# Altium schematic sheet ECU_AutoRC_UC0_r00.SchDoc
size A4; SheetNumber: 2; SheetTotal: 9
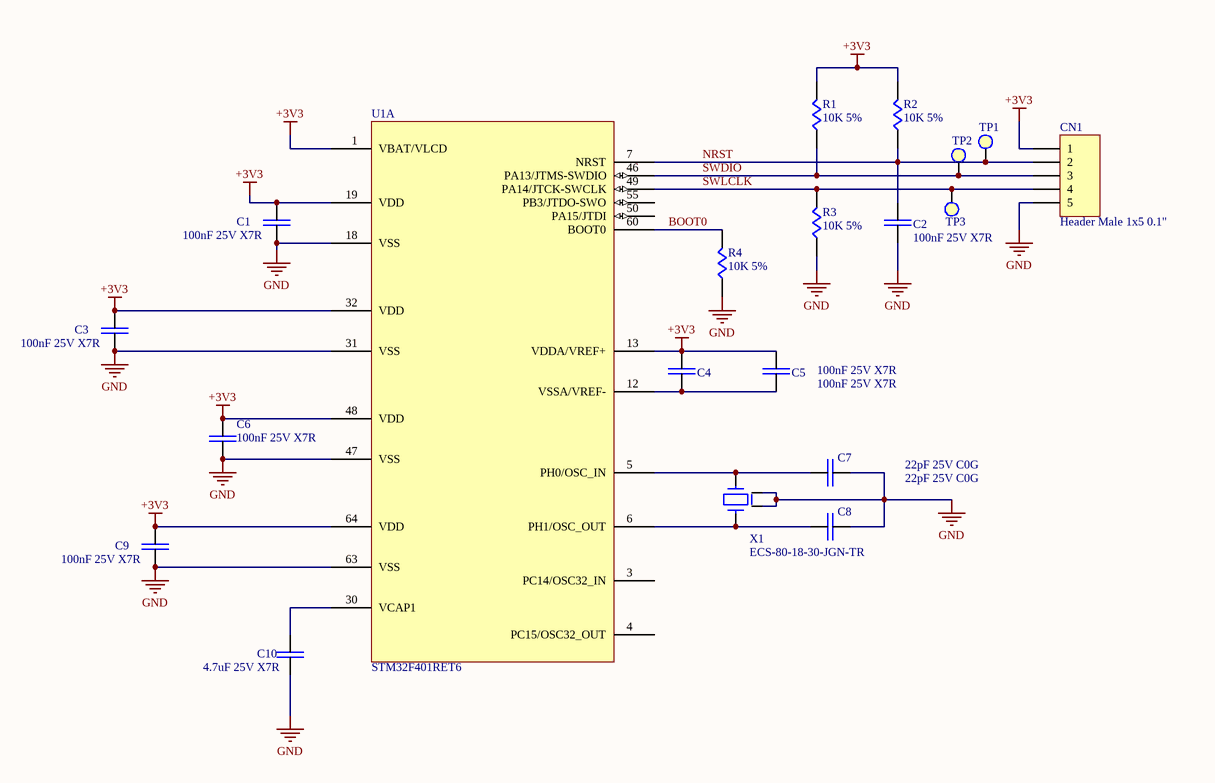
[diagram p0: ECU_AutoRC_UC0_r00.SchDoc]

## Parts
C1  100nF 25V X7R  [C_0805]
C2  100nF 25V X7R  [C_0805]
C3  100nF 25V X7R  [C_0805]
C4  100nF 25V X7R  [C_0805]
C5  100nF 25V X7R  [C_0805]
C6  100nF 25V X7R  [C_0805]
C7  22pF 25V C0G  [C_0805]
C8  22pF 25V C0G  [C_0805]
C9  100nF 25V X7R  [C_0805]
C10  4.7uF 25V X7R  [C_0805]
CN1  Header Male 1x5 0.1"  [Header_M_1x5_2mm]
R1  10K 5%  [R_0805]
R2  10K 5%  [R_0805]
R3  10K 5%  [R_0805]
R4  10K 5%  [R_0805]
TP1  Test Point  [TEST_POINT]  (value not drawn)
TP2  Test Point  [TEST_POINT]  (value not drawn)
TP3  Test Point  [TEST_POINT]  (value not drawn)
U1  STM32F401RET6  [STM32F401T6]  (part A of 2)
X1  ECS-80-18-30-JGN-TR  [XTAL_4N_ECS-80-10]

## Nets
+3V3: C1.2 C3.2 C4.1 C5.1 C6.2 C9.2 CN1.1 R1.2 R2.2 U1.1(VBAT/VLCD) U1.13(VDDA/VREF+) U1.19(VDD) U1.32(VDD) U1.48(VDD) U1.64(VDD)
GND: C1.1 C2.2 C3.1 C6.1 C7.2 C8.2 C9.1 C10.1 CN1.5 R3.1 R4.1 U1.18(VSS) U1.31(VSS) U1.47(VSS) U1.63(VSS) X1.2 X1.4
BOOT0: R4.2 U1.60(BOOT0)
NRST: C2.1 CN1.2 R2.1 TP1.1 U1.7(NRST)
SWDIO: CN1.3 R1.1 TP2.1 U1.46(PA13/JTMS-SWDIO)
SWLCLK: CN1.4 R3.2 TP3.1 U1.49(PA14/JTCK-SWCLK)
NetC4_2: C4.2 C5.2 U1.12(VSSA/VREF-)
NetC7_1: C7.1 U1.5(PH0/OSC_IN) X1.1
NetC8_1: C8.1 U1.6(PH1/OSC_OUT) X1.3
NetC10_2: C10.2 U1.30(VCAP1)

Not connected (* = marked no-connect by the designer): U1 3(PC14/OSC32_IN) 4(PC15/OSC32_OUT) 50(PA15/JTDI) 55(PB3/JTDO-SWO)

## Library data of the parts
C1-C10 = Capacitor NP: Non Polarizated Capacitor
CN1 = CONN_05P: Connector Generic 5 Vias
R1-R4 = Resistor
TP1-TP3 = TestPoint
U1 = STM32F401RE: STM32 Microcontroller
X1 = CRYSTAL_4P: Xtal 4 Ports